# Altium schematic sheet POWER_VOLTAGE.SchDoc
size B
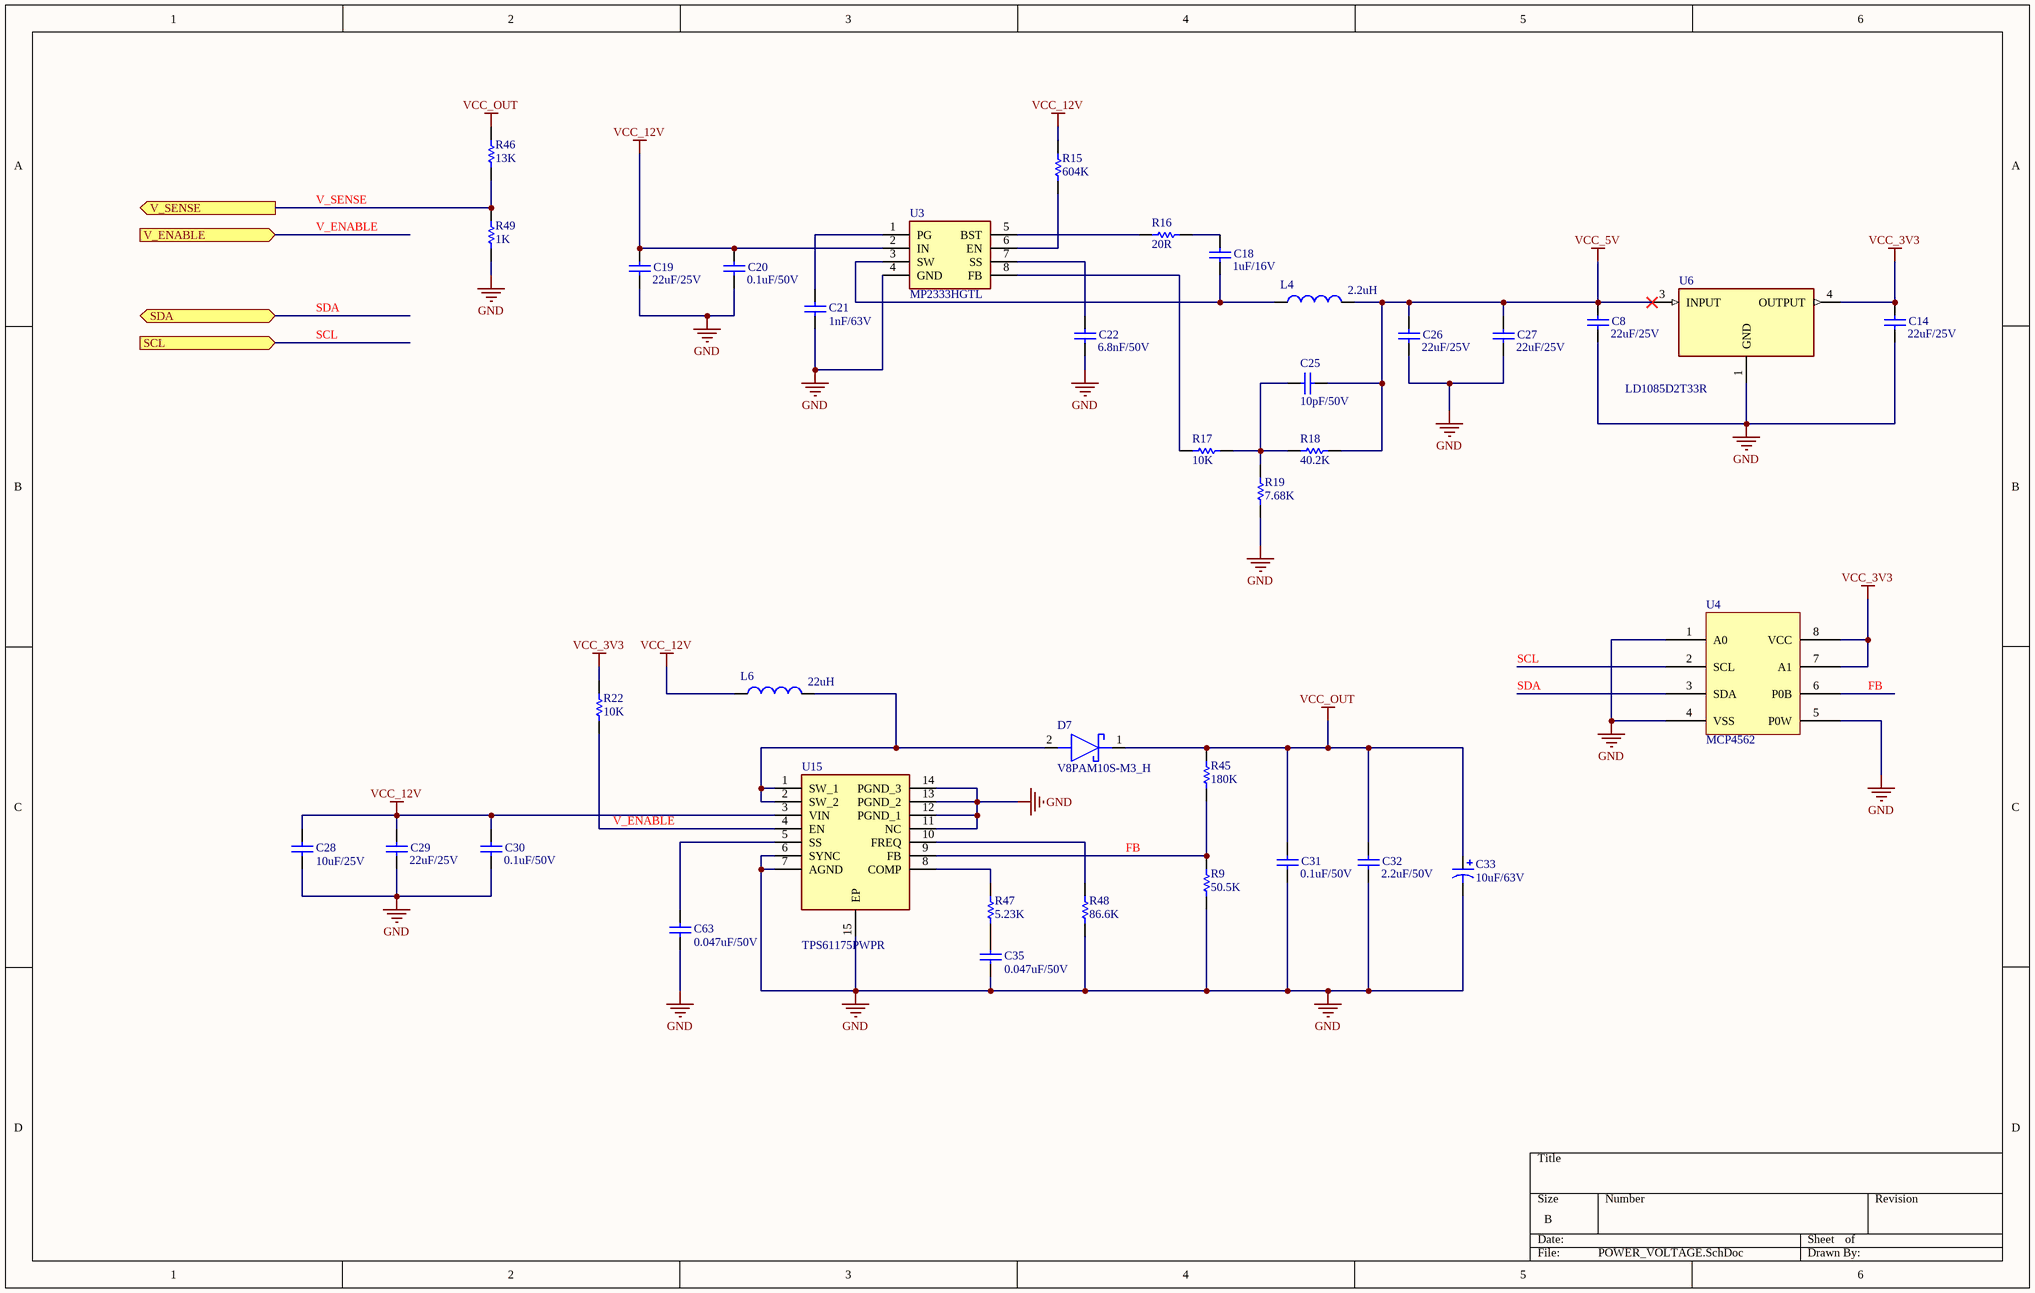
[diagram p0: POWER_VOLTAGE.SchDoc]

## Parts
C8  22uF/25V  [1210C]
C14  22uF/25V  [1210C]
C18  1uF/16V  [0603C]
C19  22uF/25V  [1210C]
C20  0.1uF/50V  [0603C]
C21  1nF/63V  [0603C]
C22  6.8nF/50V  [0603C]
C25  10pF/50V  [0603C]
C26  22uF/25V  [1210C]
C27  22uF/25V  [1210C]
C28  10uF/25V  [0805C]
C29  22uF/25V  [1210C]
C30  0.1uF/50V  [0603C]
C31  0.1uF/50V  [0603C]
C32  2.2uF/50V  [0603C]
C33  10uF/63V  [EEE-FN1J100L]
C35  0.047uF/50V  [0603C]
C63  0.047uF/50V  [0603C]
D7  V8PAM10S-M3_H  [V8PAM10SHM3H]
L4  2.2uH  [IHLP1616BZER2R2M5A]
L6  22uH  [CDRH124NP-220MC]
R9  50.5K  [0603R]
R15  604K  [0603R]
R16  20R  [0603R]
R17  10K  [0603R]
R18  40.2K  [0603R]
R19  7.68K  [0603R]
R22  10K  [0603R]
R45  180K  [0603R]
R46  13K  [0603R]
R47  5.23K  [0603R]
R48  86.6K  [0603R]
R49  1K  [0603R]
U3  MP2333HGTL  [MP2333HGTL-P]
U4  MCP4562  [MCP4562T-503E/MS]
U6  LD1085D2T33R  [LD1085D2T33R]
U15  TPS61175PWPR  [TPS61175PWPR]

## Ports
SCL (in), SDA (bidir), V_ENABLE (in), V_SENSE (out)

## Nets
GND: C8.1 C14.1 C19.1 C20.1 C21.1 C22.1 C26.1 C27.1 C28.1 C29.1 C30.1 C31.1 C32.1 C33.2 C35.1 C63.1 R9.2 R19.2 R48.1 R49.1 U3.4(GND) U4.1(A0) U4.4(VSS) U4.5(P0W) U6.1(GND) U15.6(SYNC) U15.7(AGND) U15.11(NC) U15.12(PGND_1) U15.13(PGND_2) U15.14(PGND_3) U15.15(EP)
VCC_3V3: C14.2 R22.1 U4.7(A1) U4.8(VCC) U6.4(OUTPUT)
VCC_5V: C8.2 C25.1 C26.2 C27.2 L4.2 R18.2 U6.3(INPUT)
VCC_12V: C19.2 C20.2 C28.2 C29.2 C30.2 L6.1 R15.2 U3.2(IN) U15.3(VIN)
VCC_OUT: C31.2 C32.2 C33.1 D7.1(K) R45.1 R46.1
FB: R9.1 R45.2 U4.6(P0B) U15.9(FB)
SCL: U4.2(SCL) ; port SCL
SDA: U4.3(SDA) ; port SDA
V_ENABLE: R22.2 U15.4(EN) ; port V_ENABLE
V_SENSE: R46.2 R49.2 ; port V_SENSE
NetC18_1: C18.1 L4.1 U3.3(SW)
NetC18_2: C18.2 R16.2
NetC21_2: C21.2 U3.1(PG)
NetC22_2: C22.2 U3.7(SS)
NetC25_2: C25.2 R17.1 R18.1 R19.1
NetC35_2: C35.2 R47.1
NetC63_2: C63.2 U15.5(SS)
NetD7_2: D7.2(A) L6.2 U15.1(SW_1) U15.2(SW_2)
NetR15_1: R15.1 U3.6(EN)
NetR16_1: R16.1 U3.5(BST)
NetR17_2: R17.2 U3.8(FB)
NetR47_2: R47.2 U15.8(COMP)
NetR48_2: R48.2 U15.10(FREQ)

## Library data of the parts
C8 C14 C19 C26 C27 C29 = Cap: Multilayer Ceramic Capacitors MLCC - SMD/SMT 1210 25VDC 22uF 20% X7R AEC-Q200; Mfr: Taiyo Yuden; Mfr Part No: TMK325B7226MMHP; Package: 1210; Price: 0.807; Stockiest: MOUSER; Stockiest Part No: 963-TMK325B7226MMHP; Value: 22uF/25V
C18 = Cap: Multilayer Ceramic Capacitors MLCC - SMD/SMT 16volts 1uF X7R 10%; Mfr: KEMET; Mfr Part No: C0603C105K4RAC7411; Package: 0603; Price: 0.101; Stockiest: MOUSER; Stockiest Part No: 80-C0603C105K4RLR; Value: 1uF/16V
C20 C30 C31 = Cap: Multilayer Ceramic Capacitors MLCC - SMD/SMT 50V 0.1uF 0603 X7R 20%; Mfr: KEMET; Mfr Part No: C0603C104M5RACTU; Package: 0603; Price: 0.101; Stockiest: MOUSER; Stockiest Part No: 80-C0603C104M5R; Value: 0.1uF/50V
C21 = Cap: Multilayer Ceramic Capacitors MLCC - SMD/SMT 63V 1000pF 0603 X7R 10% AEC-Q200; Mfr: KEMET; Mfr Part No: 80-C0603C102KMREAUTO; Package: 0603; Price: 0.201; Stockiest: MOUSER; Stockiest Part No: C0603C102KMRECAUTO; Value: 1nF/63V
C22 = Cap: Multilayer Ceramic Capacitors MLCC - SMD/SMT 0603 50VDC 6.8nF 5% C0G AEC-Q200; Mfr: TDK; Mfr Part No: CGA3E2C0G1H682J080AE; Package: 0603; Price: 0.363; Stockiest: MOUSER; Stockiest Part No: 810-CGA3E2C0G1H682J8; Value: 6.8nF/50V
C25 = Cap: Multilayer Ceramic Capacitors MLCC - SMD/SMT 50V 10pF 0603 C0G 5% AEC-Q200; Mfr: KEMET; Mfr Part No: C0603C100J5GACAUTO; Package: 0603; Price: 0.192; Stockiest: MOUSER; Stockiest Part No: 80-C0603C100J5GAUTO; Value: 10pF/50V
C28 = Cap: Multilayer Ceramic Capacitors MLCC - SMD/SMT 0805 25VDC 10uF 20% X5R; Mfr: Taiyo Yuden; Mfr Part No: TMK212BBJ106MG-T; Package: 0805; Price: 0.232; Stockiest: MOUSER; Stockiest Part No: 963-TMK212BBJ106MG-T; Value: 10uF/25V
C32 = Cap: Multilayer Ceramic Capacitors MLCC - SMD/SMT 0603 2.2uF 20% 50VDC X5R; Mfr: Murata Electronics; Mfr Part No: GRM188R61H225ME11J; Package: 0603; Price: 0.333; Stockiest: MOUSER; Stockiest Part No: 81-GRM188R61H225ME1J; Value: 2.2uF/50V
C33 = Cap Pol1: Polarized Capacitor (Radial); Mfr: Panasonic; Value: 10uF/63V; Mfr Part No: EEE-FN1J100L; Package: SMD; Stockiest: MOUSER; Price: 0.484; Stockiest Part No: 667-EEE-FN1J100L
C35 C63 = Cap: Multilayer Ceramic Capacitors MLCC - SMD/SMT 50V 0.047uF 0603 X7R 10%; Mfr: KEMET; Mfr Part No: C0603C473K5RAC7411; Package: 0603; Price: 0.121; Stockiest: MOUSER; Stockiest Part No: 80-C0603C473K5RLR; Value: 0.047uF/50V
D7 = V8PAM10S-M3_H: Schottky Diodes & Rectifiers 8A 100V; Mfr: Vishay General Semiconductor; Mfr Part No: V8PAM10S-M3/H; Price: 0.39; Stockiest: MOUSER; Stockiest Part No: 78-V8PAM10S-M3/H
L4 = INDUCTOR: Fixed Inductors 2.2uH 20% High Temp AEC-Q200; Mfr: Vishay / Dale; Mfr Part No: IHLP1616BZER2R2M5A; Price: 1.36; Stockiest: MOUSER; Stockiest Part No: 70-IHLP1616BZR2R2M5A; Value: 2.2uH
L6 = INDUCTOR: Fixed Inductors 22uH 2.9A 20% SMD PWR INDUCTOR; Mfr: Sumida; Mfr Part No: CDRH124NP-220MC; Price: 1.42; Stockiest: MOUSER; Stockiest Part No: 851-CDRH124NP-220MC; Value: 22uH
R9 = Res1: Thin Film Resistors - SMD 50.5kOhm,0603,0.1%,2 5ppm,63mW,50V; Mfr: KOA Speer; Mfr Part No: RN731JTTD5052B25; Package: 0603; Price: 0.8; Stockiest: MOUSER; Stockiest Part No: 660-RN731JTTD5052B25; Value: 50.5K
R15 = Res1: Thick Film Resistors - SMD 0603 1% 604Kohm Anti-Sulfur AEC-Q200; Mfr: Panasonic; Mfr Part No: ERJ-U03F6043V; Package: 0603; Price: 0.221; Stockiest: MOUSER; Stockiest Part No: 667-ERJ-U03F6043V; Value: 604K
R16 = Res1: Thick Film Resistors - SMD 0603 0.25W 1% 20ohm AEC-Q200; Mfr: Panasonic; Mfr Part No: ERJ-UP3F20R0V; Package: 0603; Price: 0.262; Stockiest: MOUSER; Stockiest Part No: 667-ERJ-UP3F20R0V; Value: 20R
R17 R22 = Res1: Thick Film Resistors - SMD 0603 10Kohms 1% Anti-Sulfur AEC-Q200; Mfr: ROHM Semiconductor; Mfr Part No: SFR03EZPF1002; Package: 0603; Price: 0.101; Stockiest: MOUSER; Stockiest Part No: 755-SFR03EZPF1002; Value: 10K
R18 = Res1: Thick Film Resistors - SMD 0603 Anti-Surge Res. 0.1%, 40.2Koh; Mfr: Panasonic; Mfr Part No: ERJ-PB3B4022V; Package: 0603; Price: 0.252; Stockiest: MOUSER; Stockiest Part No: 667-ERJ-PB3B4022V; Value: 40.2K
R19 = Res1: Thick Film Resistors - SMD 0603 Anti-Surge Res. 0.1%, 7.68Koh; Mfr: Panasonic; Mfr Part No: ERJ-PB3B7681V; Package: 0603; Price: 0.252; Stockiest: MOUSER; Stockiest Part No: 667-ERJ-PB3B7681V; Value: 7.68K
R45 = Res1: Thin Film Resistors - SMD 180K ohm 0.1% 50 ppm; Mfr: KOA Speer; Mfr Part No: RN73R1JTTD1803B50; Package: 0603; Price: 0.8; Stockiest: MOUSER; Stockiest Part No: 660-RN73R1JTD1803B50; Value: 180K
R46 = Res1: Thin Film Resistors - SMD 13K ohm 0.1% 25 ppm; Mfr: KOA Speer; Mfr Part No: RN73R1JTTD1302B25; Package: 0603; Price: 0.503; Stockiest: MOUSER; Stockiest Part No: 660-RN73R1JTD1302B25; Value: 13K
R47 = Res1: Thick Film Resistors - SMD 0603 5.23Kohms 1% AEC-Q200; Mfr: Panasonic; Mfr Part No: ERJ-3EKF5231V; Package: 0603; Price: 0.101; Stockiest: MOUSER; Stockiest Part No: 667-ERJ-3EKF5231V; Value: 5.23K
R48 = Res1: Thick Film Resistors - SMD 0603 86.6Kohms 1% AEC-Q200; Mfr: Panasonic; Mfr Part No: ERJ-3EKF8662V; Package: 0603; Price: 0.101; Stockiest: MOUSER; Stockiest Part No: 667-ERJ-3EKF8662V; Value: 86.6K
R49 = Res1: Resistor; Mfr: Vishay / Dale; Mfr Part No: CRCW06031K00FKEAC; Package: 0603; Price: 0.1; Stockiest: MOUSER; Stockiest Part No: 71-CRCW06031K00FKEAC; Value: 1K
U3 = MP2333HGTL: Switching Voltage Regulators High-Efficiency, 3A, 18V, 1200kHz, Synchronous, Step-Down Converter; Mfr: Monolithic Power Systems (MPS); Value: 3.3V; Mfr Part No: MP2333HGTL-P; Price: 1.89; Stockiest: MOUSER; Stockiest Part No: 946-MP2333HGTL-P
U4 = MCP4562: Digital Potentiometer ICs Sngl 8B NV I2C Rheo; Mfr: Microchip Technology; Value: 50K; Mfr Part No: MCP4562T-503E/MS; Price: 0.97; Stockiest: MOUSER; Stockiest Part No: 579-MCP4562T-503E/MS
U6 = LD1085D2T33R: Integrated Circuit; Mfr: STMicroelectronics; Value: 3.3V; Mfr Part No: LD1085D2T33R; Price: 1.30; Stockiest: MOUSER; Stockiest Part No: 511-LD1085D2T33-TR
U15 = TPS61175PWP: Switching Voltage Regulators 3A High Vltg Boost Converter; Mfr: Texas Instruments; Mfr Part No: TPS61175PWPR; Price: 3.06; Stockiest: MOUSER; Stockiest Part No: 595-TPS61175PWPR